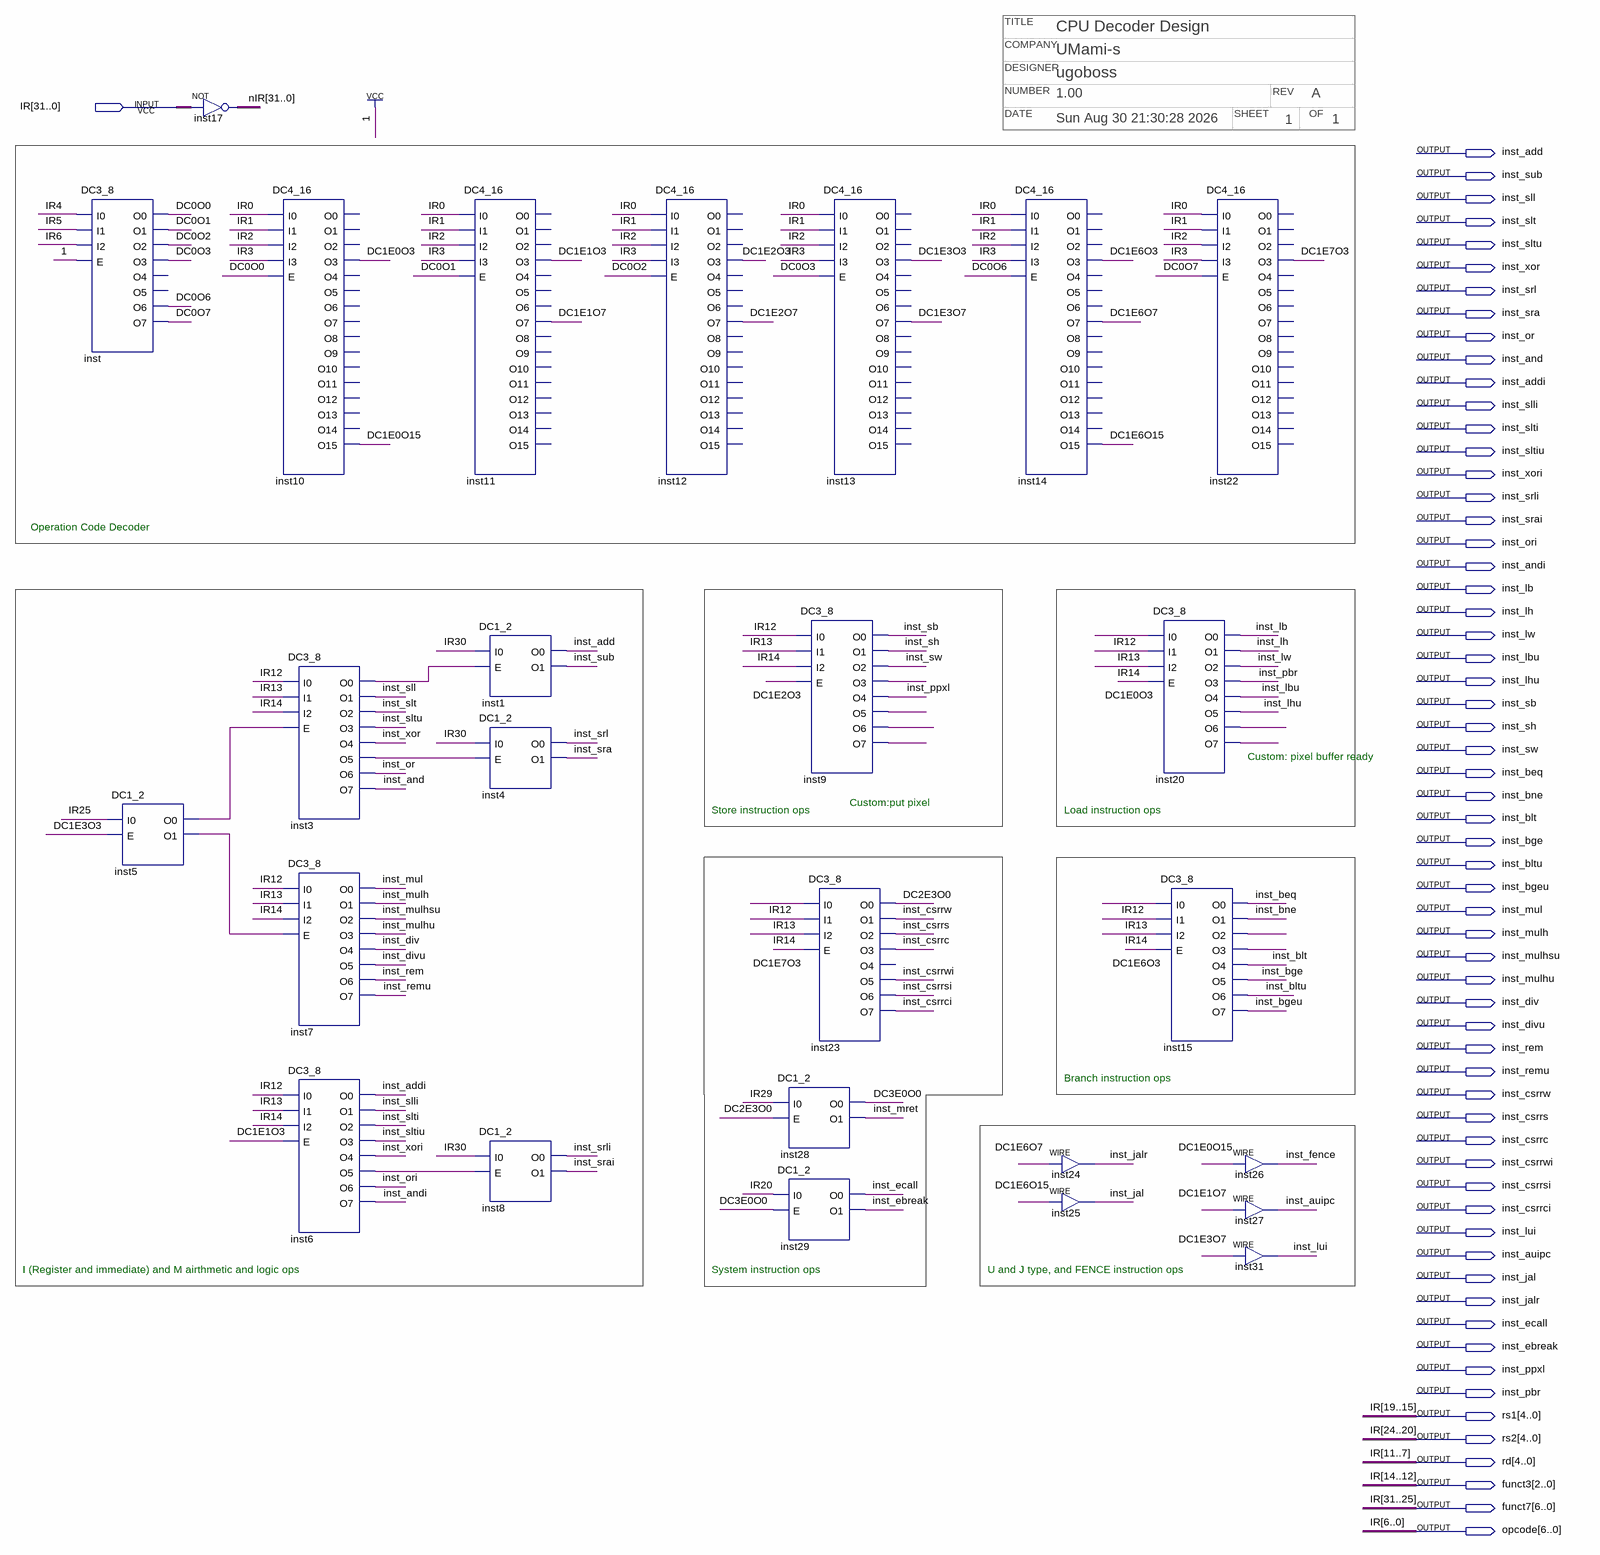
[diagram p0: schematic sheet]
// Quartus schematic Decoder.bdf as structural Verilog: 26 symbols, 62 pins
// Title block: COMPANY: UMami-s; DATE: Sun Aug 30 21:30:28 2026; DESIGNER: ugoboss; NUMBER: 1.00; OF: 1; REV: A; SHEET: 1; TITLE: CPU Decoder Design
module Decoder (
  input  [31:0] IR,
  output inst_add,
  output inst_sub,
  output inst_sll,
  output inst_slt,
  output inst_sltu,
  output inst_xor,
  output inst_srl,
  output inst_sra,
  output inst_or,
  output inst_and,
  output inst_addi,
  output inst_slli,
  output inst_slti,
  output inst_sltiu,
  output inst_xori,
  output inst_srli,
  output inst_srai,
  output inst_ori,
  output inst_andi,
  output inst_lb,
  output inst_lh,
  output inst_lw,
  output inst_lbu,
  output inst_lhu,
  output inst_sb,
  output inst_sh,
  output inst_sw,
  output inst_beq,
  output inst_bne,
  output inst_blt,
  output inst_bge,
  output inst_bltu,
  output inst_bgeu,
  output inst_mul,
  output inst_mulh,
  output inst_mulhsu,
  output inst_mulhu,
  output inst_div,
  output inst_divu,
  output inst_rem,
  output inst_remu,
  output inst_csrrw,
  output inst_csrrs,
  output inst_csrrc,
  output inst_csrrwi,
  output inst_csrrsi,
  output inst_csrrci,
  output inst_lui,
  output inst_auipc,
  output inst_jal,
  output inst_jalr,
  output inst_ecall,
  output inst_ebreak,
  output inst_ppxl,
  output inst_pbr,
  output [4:0] rs1,
  output [4:0] rs2,
  output [4:0] rd,
  output [2:0] funct3,
  output [6:0] funct7,
  output [6:0] opcode
);

  wire DC0O0, DC0O1, DC0O2, DC0O3, DC0O6, DC0O7, DC1E0O3, DC1E0O15, DC1E1O3, DC1E1O7, DC1E2O3, DC1E2O7,
       DC1E3O3, DC1E3O7, DC1E6O3, DC1E6O7, DC1E6O15, DC1E7O3, DC2E3O0, DC3E0O0, inst3_o0, inst3_o5, inst5_o0,
       inst5_o1, inst6_o5, inst9_o3, inst9_o5, inst9_o6, inst9_o7, inst15_o2, inst15_o3, inst20_o6,
       inst20_o7, inst_fence, inst_mret;
  wire [31:0] nIR;

  DC3_8 inst (
    .I0(IR[4]), .I1(IR[5]), .I2(IR[6]), .E(1'b1), .O0(DC0O0), .O1(DC0O1), .O2(DC0O2), .O3(DC0O3), .O6(DC0O6),
    .O7(DC0O7));  // open: O4, O5
  DC1_2 inst5 (.I0(IR[25]), .E(DC1E3O3), .O0(inst5_o0), .O1(inst5_o1));
  assign nIR = ~IR;  // NOT inst17, 32 bits wide
  DC4_16 inst10 (
    .I0(IR[0]), .I1(IR[1]), .I2(IR[2]), .I3(IR[3]), .E(DC0O0), .O3(DC1E0O3), .O15(DC1E0O15));  // open: O0, O1, O2, O4, O5, O6, O7, O8, O9, O10, O11, O12, O13, O14
  DC3_8 inst3 (
    .I0(IR[12]), .I1(IR[13]), .I2(IR[14]), .E(inst5_o0), .O0(inst3_o0), .O1(inst_sll), .O2(inst_slt),
    .O3(inst_sltu), .O4(inst_xor), .O5(inst3_o5), .O6(inst_or), .O7(inst_and));
  DC3_8 inst7 (
    .I0(IR[12]), .I1(IR[13]), .I2(IR[14]), .E(inst5_o1), .O0(inst_mul), .O1(inst_mulh), .O2(inst_mulhsu),
    .O3(inst_mulhu), .O4(inst_div), .O5(inst_divu), .O6(inst_rem), .O7(inst_remu));
  DC3_8 inst6 (
    .I0(IR[12]), .I1(IR[13]), .I2(IR[14]), .E(DC1E1O3), .O0(inst_addi), .O1(inst_slli), .O2(inst_slti),
    .O3(inst_sltiu), .O4(inst_xori), .O5(inst6_o5), .O6(inst_ori), .O7(inst_andi));
  DC4_16 inst11 (
    .I0(IR[0]), .I1(IR[1]), .I2(IR[2]), .I3(IR[3]), .E(DC0O1), .O3(DC1E1O3), .O7(DC1E1O7));  // open: O0, O1, O2, O4, O5, O6, O8, O9, O10, O11, O12, O13, O14, O15
  DC1_2 inst1 (.I0(IR[30]), .E(inst3_o0), .O0(inst_add), .O1(inst_sub));
  DC1_2 inst4 (.I0(IR[30]), .E(inst3_o5), .O0(inst_srl), .O1(inst_sra));
  DC1_2 inst8 (.I0(IR[30]), .E(inst6_o5), .O0(inst_srli), .O1(inst_srai));
  DC4_16 inst12 (
    .I0(IR[0]), .I1(IR[1]), .I2(IR[2]), .I3(IR[3]), .E(DC0O2), .O3(DC1E2O3), .O7(DC1E2O7));  // open: O0, O1, O2, O4, O5, O6, O8, O9, O10, O11, O12, O13, O14, O15
  DC4_16 inst13 (
    .I0(IR[0]), .I1(IR[1]), .I2(IR[2]), .I3(IR[3]), .E(DC0O3), .O3(DC1E3O3), .O7(DC1E3O7));  // open: O0, O1, O2, O4, O5, O6, O8, O9, O10, O11, O12, O13, O14, O15
  DC3_8 inst9 (
    .I0(IR[12]), .I1(IR[13]), .I2(IR[14]), .E(DC1E2O3), .O0(inst_sb), .O1(inst_sh), .O2(inst_sw),
    .O3(inst9_o3), .O4(inst_ppxl), .O5(inst9_o5), .O6(inst9_o6), .O7(inst9_o7));
  DC3_8 inst23 (
    .I0(IR[12]), .I1(IR[13]), .I2(IR[14]), .E(DC1E7O3), .O0(DC2E3O0), .O1(inst_csrrw), .O2(inst_csrrs),
    .O3(inst_csrrc), .O5(inst_csrrwi), .O6(inst_csrrsi), .O7(inst_csrrci));  // open: O4
  DC1_2 inst28 (.I0(IR[29]), .E(DC2E3O0), .O0(DC3E0O0), .O1(inst_mret));
  DC1_2 inst29 (.I0(IR[20]), .E(DC3E0O0), .O0(inst_ecall), .O1(inst_ebreak));
  DC4_16 inst14 (
    .I0(IR[0]), .I1(IR[1]), .I2(IR[2]), .I3(IR[3]), .E(DC0O6), .O3(DC1E6O3), .O7(DC1E6O7), .O15(DC1E6O15));  // open: O0, O1, O2, O4, O5, O6, O8, O9, O10, O11, O12, O13, O14
  assign inst_jalr = DC1E6O7;  // WIRE inst24
  assign inst_jal = DC1E6O15;  // WIRE inst25
  DC3_8 inst20 (
    .I0(IR[12]), .I1(IR[13]), .I2(IR[14]), .E(DC1E0O3), .O0(inst_lb), .O1(inst_lh), .O2(inst_lw),
    .O3(inst_pbr), .O4(inst_lbu), .O5(inst_lhu), .O6(inst20_o6), .O7(inst20_o7));
  DC3_8 inst15 (
    .I0(IR[12]), .I1(IR[13]), .I2(IR[14]), .E(DC1E6O3), .O0(inst_beq), .O1(inst_bne), .O2(inst15_o2),
    .O3(inst15_o3), .O4(inst_blt), .O5(inst_bge), .O6(inst_bltu), .O7(inst_bgeu));
  DC4_16 inst22 (
    .I0(IR[0]), .I1(IR[1]), .I2(IR[2]), .I3(IR[3]), .E(DC0O7), .O3(DC1E7O3));  // open: O0, O1, O2, O4, O5, O6, O7, O8, O9, O10, O11, O12, O13, O14, O15
  assign inst_fence = DC1E0O15;  // WIRE inst26
  assign inst_auipc = DC1E1O7;  // WIRE inst27
  assign inst_lui = DC1E3O7;  // WIRE inst31

  assign funct3 = IR[14:12];
  assign funct7 = IR[31:25];
  assign opcode = IR[6:0];
  assign rd = IR[11:7];
  assign rs1 = IR[19:15];
  assign rs2 = IR[24:20];

  // Notes on the sheet:
  //   Operation Code Decoder
  //   Custom: pixel buffer ready
  //   Custom:put pixel
  //   Store instruction ops
  //   Load instruction ops
  //   Branch instruction ops
  //   I (Register and immediate) and M airthmetic and logic ops
  //   System instruction ops
  //   U and J type, and FENCE instruction ops
endmodule
